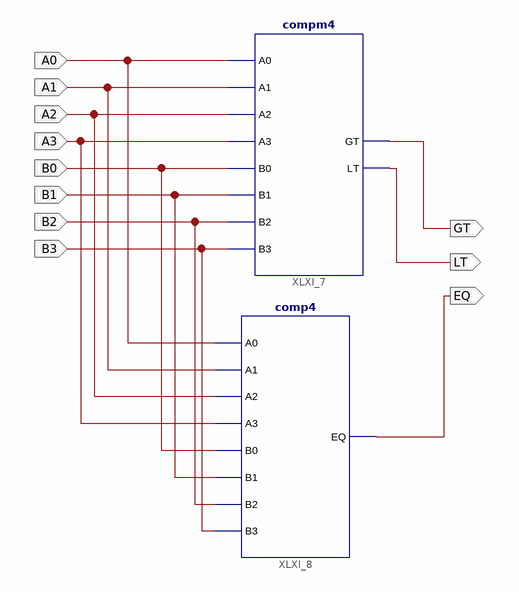
[diagram p0: schematic sheet 1]
// Xilinx ISE schematic zad4_sch.sch (artix7) as structural Verilog: 2 symbols, 11 ports
module zad4_sch (
  input  B3,
  input  B2,
  input  B1,
  input  B0,
  input  A3,
  input  A2,
  input  A1,
  input  A0,
  output GT,
  output LT,
  output EQ
);

  compm4 XLXI_7 (.A0(A0), .A1(A1), .A2(A2), .A3(A3), .B0(B0), .B1(B1), .B2(B2), .B3(B3), .GT(GT), .LT(LT));
  comp4 XLXI_8 (.A0(A0), .A1(A1), .A2(A2), .A3(A3), .B0(B0), .B1(B1), .B2(B2), .B3(B3), .EQ(EQ));
endmodule
